# Altium schematic sheet fastic.SchDoc: FastIC+ readout
size 594 x 420 mm; CheckedBy: Jerome A. Alozy; CompanyName: CERN; DrawnBy: Vojtech Vosahlo; Organization: CERN; Address1: European Organization for Nuclear Research; Address2: CH-1211 Genève 23 - Switzerland; Revision: 2.0; SheetNumber: 2; SheetTotal: 7; Projet: Fast Timing; ModifiedBy: -; CreateDate: 11/1/2024; CheckedDate: -; DivGrp: EP-ESE; Designer: Vojtech Vosahlo; ModifiedDate: -
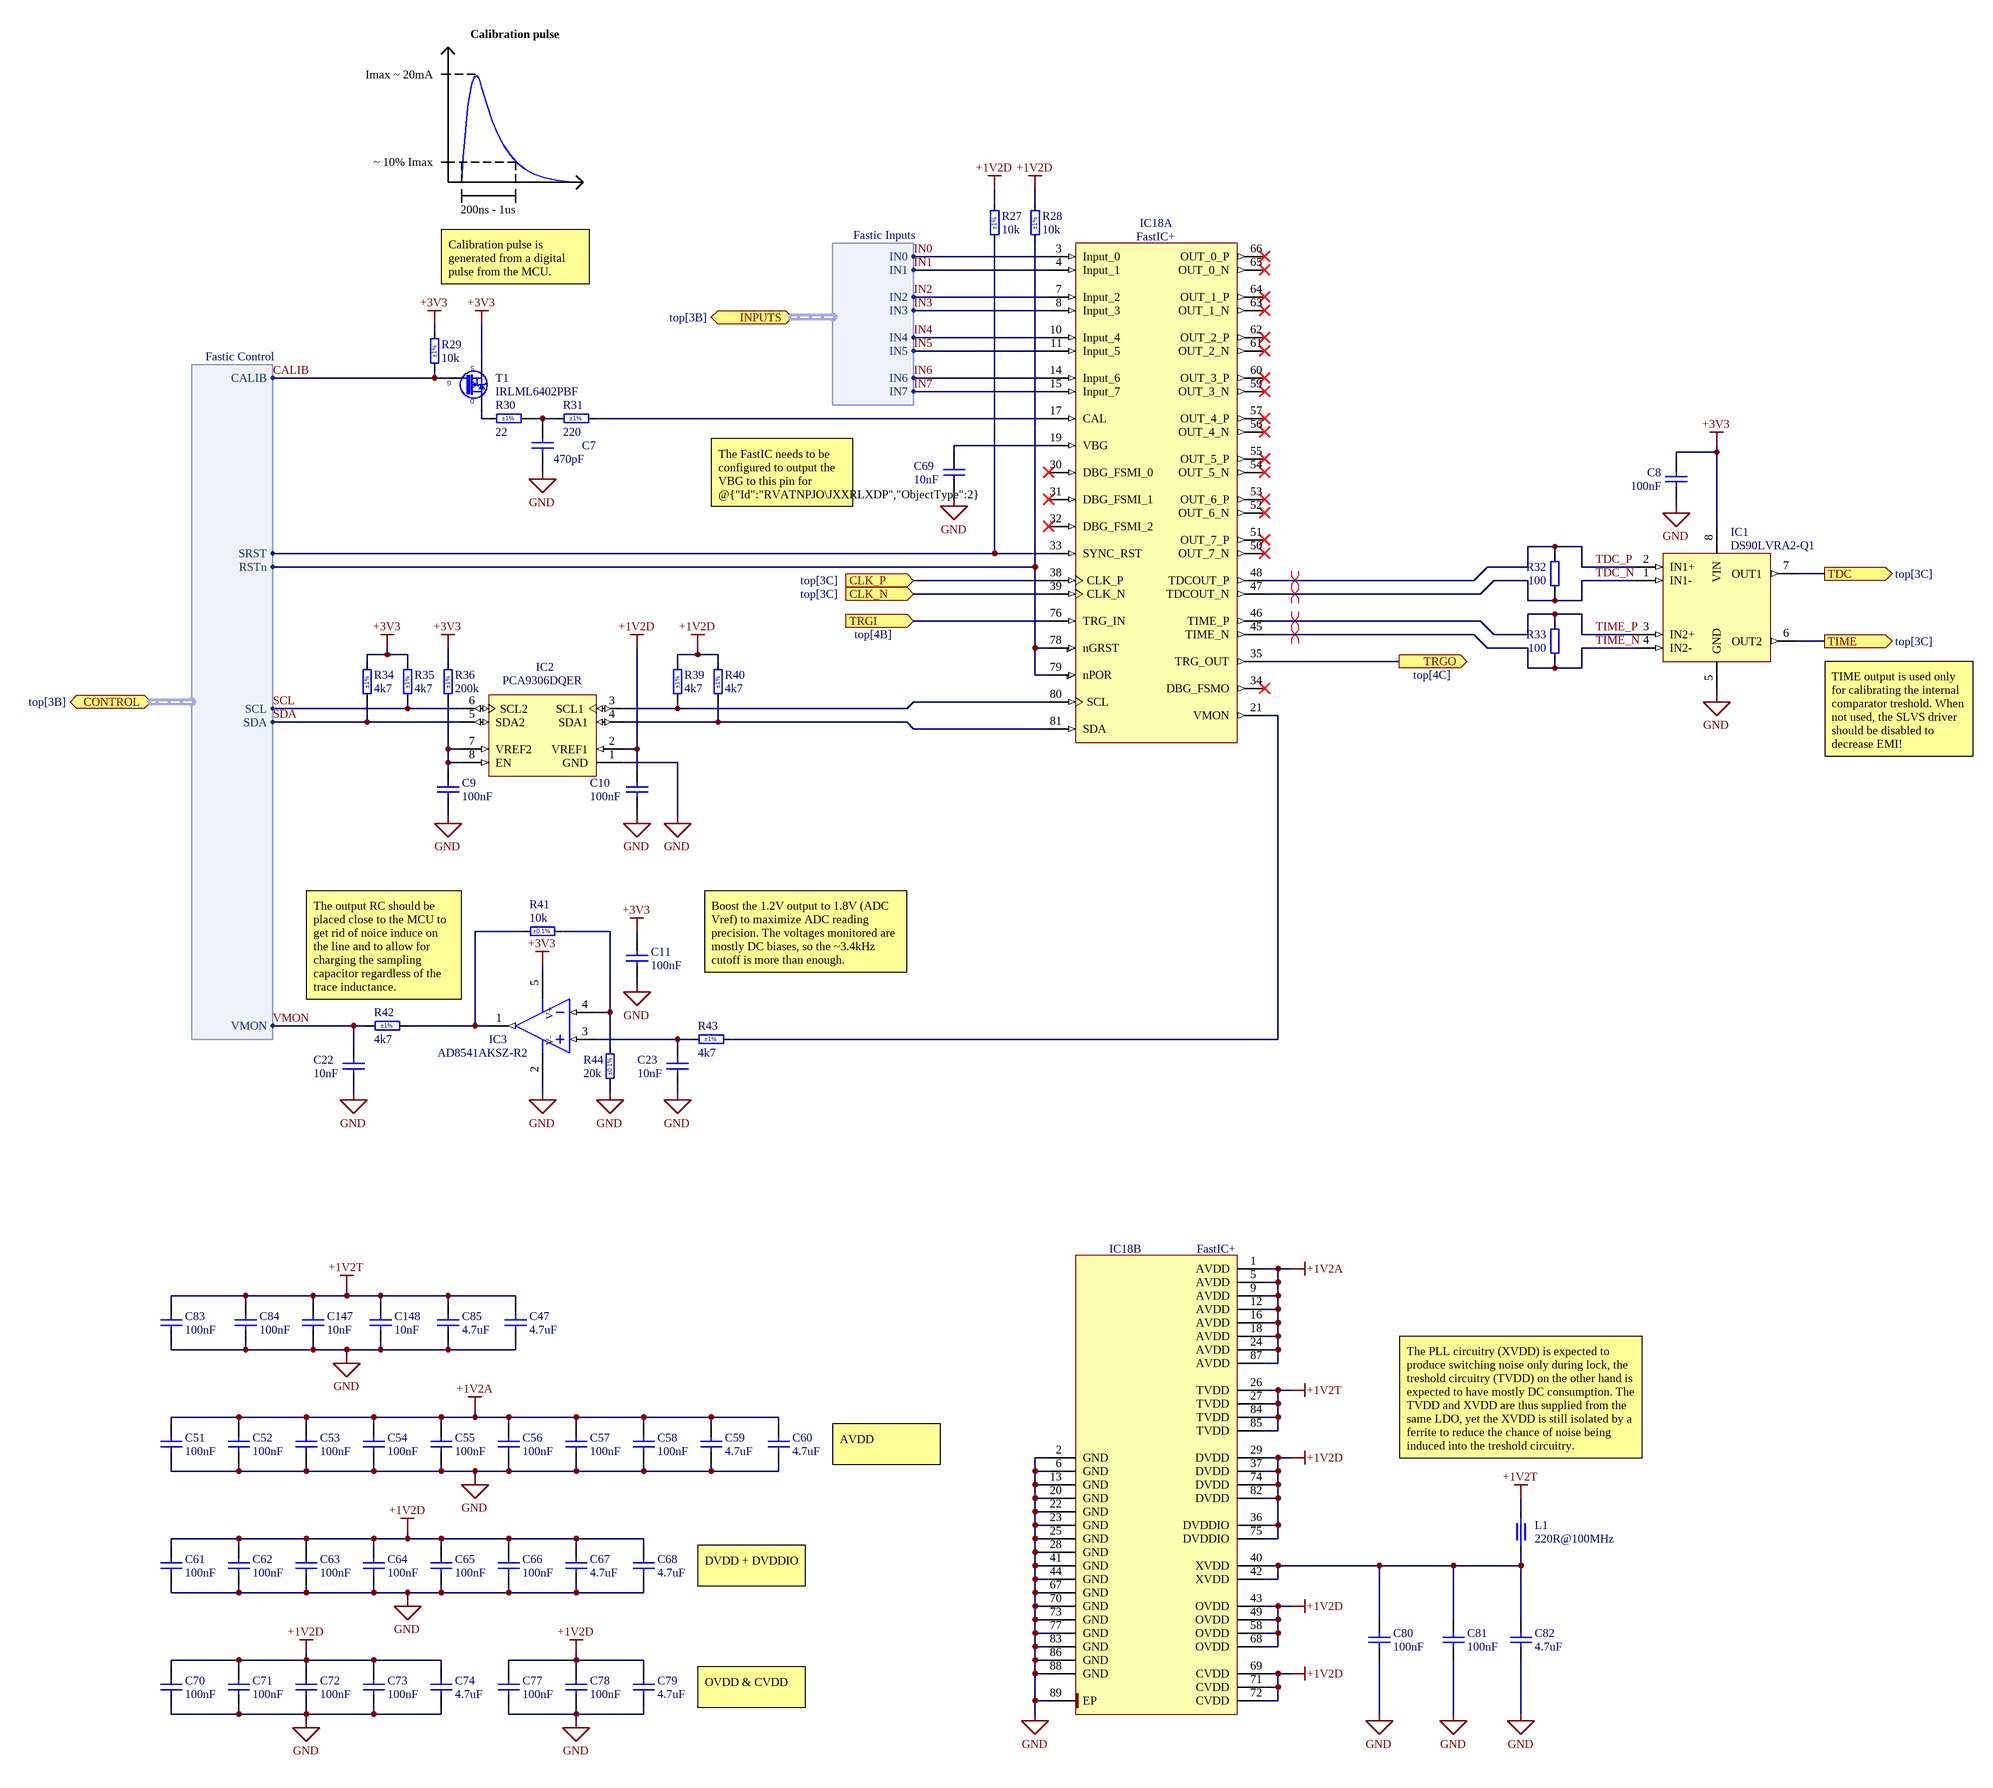
[diagram p0: fastic.SchDoc]

## Parts
C7  470pF  [CAPC1005X55N]
C8  100nF  [CAPC1005X55N]
C9  100nF  [CAPC1005X55N]
C10  100nF  [CAPC1005X55N]
C11  100nF  [CAPC1005X55N]
C22  10nF  [CAPC1005X55N]
C23  10nF  [CAPC1005X55N]
C47  4.7uF  [CAPC1608X87N]
C51  100nF  [CAPC1005X55N]
C52  100nF  [CAPC1005X55N]
C53  100nF  [CAPC1005X55N]
C54  100nF  [CAPC1005X55N]
C55  100nF  [CAPC1005X55N]
C56  100nF  [CAPC1005X55N]
C57  100nF  [CAPC1005X55N]
C58  100nF  [CAPC1005X55N]
C59  4.7uF  [CAPC1608X87N]
C60  4.7uF  [CAPC1608X87N]
C61  100nF  [CAPC1005X55N]
C62  100nF  [CAPC1005X55N]
C63  100nF  [CAPC1005X55N]
C64  100nF  [CAPC1005X55N]
C65  100nF  [CAPC1005X55N]
C66  100nF  [CAPC1005X55N]
C67  4.7uF  [CAPC1608X87N]
C68  4.7uF  [CAPC1608X87N]
C69  10nF  [CAPC1005X55N]
C70  100nF  [CAPC1005X55N]
C71  100nF  [CAPC1005X55N]
C72  100nF  [CAPC1005X55N]
C73  100nF  [CAPC1005X55N]
C74  4.7uF  [CAPC1608X87N]
C77  100nF  [CAPC1005X55N]
C78  100nF  [CAPC1005X55N]
C79  4.7uF  [CAPC1608X87N]
C80  100nF  [CAPC1005X55N]
C81  100nF  [CAPC1005X55N]
C82  4.7uF  [CAPC1608X87N]
C83  100nF  [CAPC1005X55N]
C84  100nF  [CAPC1005X55N]
C85  4.7uF  [CAPC1608X87N]
C147  10nF  [CAPC1005X55N]
C148  10nF  [CAPC1005X55N]
IC1  DS90LVRA2-Q1  [DS90LVRA2-Q1]
IC2  PCA9306DQER  [SON35P100X140X40-8N]
IC3  AD8541AKSZ-R2  [SOT65P210X110-5N]
IC18  FastIC+  [QFN40P1000X1000X85-89N-S760]  (parts A,B of 2)
L1  220R@100MHz  [INDC1005X55N]
R27  10k  Tolerance: ±1%  [RESC1005X40N]
R28  10k  Tolerance: ±1%  [RESC1005X40N]
R29  10k  Tolerance: ±1%  [RESC1005X40N]
R30  22  Tolerance: ±1%  [RESC1005X40N]
R31  220  Tolerance: ±1%  [RESC1005X40N]
R32  100  [RESC1005X40N]
R33  100  [RESC1005X40N]
R34  4k7  Tolerance: ±1%  [RESC1005X40N]
R35  4k7  Tolerance: ±1%  [RESC1005X40N]
R36  200k  Tolerance: ±1%  [RESC1005X40N]
R39  4k7  Tolerance: ±1%  [RESC1005X40N]
R40  4k7  Tolerance: ±1%  [RESC1005X40N]
R41  10k  Tolerance: ±0.1%  [RESC1005X35N]
R42  4k7  Tolerance: ±1%  [RESC1005X40N]
R43  4k7  Tolerance: ±1%  [RESC1005X40N]
R44  20k  Tolerance: ±0.1%  [RESC1005X40N]
T1  IRLML6402PBF  [SOT95P237X112-3N]

## Ports
CLK_N (in, see top[3C]), CLK_P (in, see top[3C]), CONTROL (bidir, harness Fastic Control, see top[3B]), INPUTS (bidir, harness Fastic Inputs, see top[3B]), TDC (out, see top[3C]), TIME (out, see top[3C]), TRGI (in, see top[4B]), TRGO (out, see top[4C])

## Harnesses
Fastic Inputs: IN0, IN1, IN2, IN3, IN4, IN5, IN6, IN7
Fastic Control: CALIB, SRST, RSTn, SDA, VMON, SCL

## Nets
+1V2A: C51.1 C52.1 C53.1 C54.1 C55.1 C56.1 C57.1 C58.1 C59.1 C60.1 IC18.1(AVDD) IC18.5(AVDD) IC18.9(AVDD) IC18.12(AVDD) IC18.16(AVDD) IC18.18(AVDD) IC18.24(AVDD) IC18.87(AVDD)
+1V2D: C10.1 C61.1 C62.1 C63.1 C64.1 C65.1 C66.1 C67.1 C68.1 C70.1 C71.1 C72.1 C73.1 C74.1 C77.1 C78.1 C79.1 IC2.2(VREF1) IC18.29(DVDD) IC18.36(DVDDIO) IC18.37(DVDD) IC18.43(OVDD) IC18.49(OVDD) IC18.58(OVDD) IC18.68(OVDD) IC18.69(CVDD) IC18.71(CVDD) IC18.72(CVDD) IC18.74(DVDD) IC18.75(DVDDIO) IC18.82(DVDD) R27.2 R28.2 R39.2 R40.2
+1V2T: C47.1 C83.1 C84.1 C85.1 C147.1 C148.1 IC18.26(TVDD) IC18.27(TVDD) IC18.84(TVDD) IC18.85(TVDD) L1.2
+3V3: C8.1 C11.2 IC1.8(VIN) IC3.5(V+) R29.2 R34.2 R35.2 R36.2 T1.2(S)
GND: C7.1 C8.2 C9.2 C10.2 C11.1 C22.1 C23.1 C47.2 C51.2 C52.2 C53.2 C54.2 C55.2 C56.2 C57.2 C58.2 C59.2 C60.2 C61.2 C62.2 C63.2 C64.2 C65.2 C66.2 C67.2 C68.2 C69.2 C70.2 C71.2 C72.2 C73.2 C74.2 C77.2 C78.2 C79.2 C80.2 C81.2 C82.2 C83.2 C84.2 C85.2 C147.2 C148.2 IC1.5(GND) IC2.1(GND) IC3.2(V-) IC18.2(GND) IC18.6(GND) IC18.13(GND) IC18.20(GND) IC18.22(GND) IC18.23(GND) IC18.25(GND) IC18.28(GND) IC18.41(GND) IC18.44(GND) IC18.67(GND) IC18.70(GND) IC18.73(GND) IC18.77(GND) IC18.83(GND) IC18.86(GND) IC18.88(GND) IC18.89(EP) R44.1
CALIB: R29.1 T1.1(G) ; port CONTROL.CALIB
CLK_N: IC18.39(CLK_N) ; port CLK_N
CLK_P: IC18.38(CLK_P) ; port CLK_P
IN0: IC18.3(Input_0) ; port INPUTS.IN0
IN1: IC18.4(Input_1) ; port INPUTS.IN1
IN2: IC18.7(Input_2) ; port INPUTS.IN2
IN3: IC18.8(Input_3) ; port INPUTS.IN3
IN4: IC18.10(Input_4) ; port INPUTS.IN4
IN5: IC18.11(Input_5) ; port INPUTS.IN5
IN6: IC18.14(Input_6) ; port INPUTS.IN6
IN7: IC18.15(Input_7) ; port INPUTS.IN7
SCL: IC2.6(SCL2) R35.1 ; port CONTROL.SCL
SDA: IC2.5(SDA2) R34.1 ; port CONTROL.SDA
TDC: IC1.7(OUT1) ; port TDC
TDC_N: IC1.1(IN1-) IC18.47(TDCOUT_N) R32.2
TDC_P: IC1.2(IN1+) IC18.48(TDCOUT_P) R32.1
TIME: IC1.6(OUT2) ; port TIME
TIME_N: IC1.4(IN2-) IC18.45(TIME_N) R33.2
TIME_P: IC1.3(IN2+) IC18.46(TIME_P) R33.1
TRGI: IC18.76(TRG_IN) ; port TRGI
TRGO: IC18.35(TRG_OUT) ; port TRGO
VMON: C22.2 R42.2 ; port CONTROL.VMON
NetC7_2: C7.2 R30.2 R31.1
NetC9_1: C9.1 IC2.7(VREF2) IC2.8(EN) R36.1
NetC23_2: C23.2 IC3.3(IN+) R43.2
NetC69_1: C69.1 IC18.19(VBG)
NetC80_1: C80.1 C81.1 C82.1 IC18.40(XVDD) IC18.42(XVDD) L1.1
NetIC2_3: IC2.3(SCL1) IC18.80(SCL) R39.1
NetIC2_4: IC2.4(SDA1) IC18.81(SDA) R40.1
NetIC3_1: IC3.1(OUT) R41.1 R42.1
NetIC3_4: IC3.4(IN-) R41.2 R44.2
NetIC18_17: IC18.17(CAL) R31.2
NetIC18_21: IC18.21(VMON) R43.1
NetIC18_33: IC18.33(SYNC_RST) R27.1 ; port CONTROL.SRST
NetIC18_78: IC18.78(nGRST) IC18.79(nPOR) R28.1 ; port CONTROL.RSTn
NetR30_1: R30.1 T1.3(D)

Not connected (* = marked no-connect by the designer): IC18 30(DBG_FSMI_0)* 31(DBG_FSMI_1)* 32(DBG_FSMI_2)* 34(DBG_FSMO)* 50(OUT_7_N)* 51(OUT_7_P)* 52(OUT_6_N)* 53(OUT_6_P)* 54(OUT_5_N)* 55(OUT_5_P)* 56(OUT_4_N)* 57(OUT_4_P)* 59(OUT_3_N)* 60(OUT_3_P)* 61(OUT_2_N)* 62(OUT_2_P)* 63(OUT_1_N)* 64(OUT_1_P)* 65(OUT_0_N)* 66(OUT_0_P)*

## Layout directives
differential pair: TDC_N, TDC_P, TIME_N, TIME_P

## Notes on the sheet
- Calibration pulse
- Imax ~ 20mA
- ~ 10% Imax
- 200ns - 1us
- Calibration pulse is generated from a digital pulse from the MCU.
- The FastIC needs to be configured to output the VBG to this pin for @{"Id":"RVATNPJO\JXXRLXDP","ObjectType":2} to take effect!
- TIME output is used only for calibrating the internal comparator treshold. When not used, the SLVS driver should be disabled to decrease EMI!
- Boost the 1.2V output to 1.8V (ADC Vref) to maximize ADC reading precision. The voltages monitored are mostly DC biases, so the ~3.4kHz cutoff is more than enough.
- (near R42) The output RC should be placed close to the MCU to get rid of noice induce on the line and to allow for charging the sampling capacitor regardless of the trace inductance.
- AVDD
- The PLL circuitry (XVDD) is expected to produce switching noise only during lock, the treshold circuitry (TVDD) on the other hand is expected to have mostly DC consumption. The TVDD and XVDD are thus supplied from the same LDO, yet the XVDD is still isolated by a ferrite to reduce the chance of noise being induced into the treshold circuitry.
- DVDD + DVDDIO
- OVDD & CVDD
- Project/Equipment
- Document
- File
- Designer
- Drawn by
- Check.by
- Last Mod.
- Print Date
- Sheet
- Size
- A2
- of
- Rev

## Library data of the parts
C7 = CC0402_470PF_50V_10%_X7R: Non-polarised capacitor; Part Description: SMD Multilayer Chip Ceramic Capacitor; Manufacturer: GENERIC; Manufacturer1 Part Number: 223858715618; Voltage: 50V; TC: X7R; Tolerance: ±10%; Part Number: CC0402_470PF_50V_10%_X7R; Component Kind: Standard; Component Type: Standard; Pin Count: 2; Value: 470pF; Status: Not Recommended; Manufacturer Part Number: CC0402_470PF_50V_10%_X7R; Case: 0402; Mounted: Yes; Socket: No; SMD: Yes; Sense: No; Manufacturer1 Example: PHYCOMP; Manufacturer1 ComponentHeight: 0.55mm; HelpURL: \\cern.ch\dfs\Applications\Altium\Datasheets\CC0402_NP0_PHYCOMP.pdf; Author: CERN DEM JLC; CreateDate: 12/3/2007; LatestRevisionDate: 12/3/2007
C8-C11 C51-C58 C61-C66 C70-C73 C77 C78 C80 C81 C83 C84 = CC0402_100NF_16V_10%_X7R: Non-polarised capacitor; Part Description: SMD Multilayer Chip Ceramic Capacitor; Manufacturer: GENERIC; Manufacturer1 Part Number: GRM155R71C104KA88D; Voltage: 16V; TC: X7R; Tolerance: ±10%; Part Number: CC0402_100NF_16V_10%_X7R; Component Kind: Standard; Component Type: Standard; Pin Count: 2; Value: 100nF; Status: Not Recommended; Manufacturer Part Number: CC0402_100NF_16V_10%_X7R; Case: 0402; Mounted: Yes; Socket: No; SMD: Yes; Sense: No; HelpURL: \\cern.ch\dfs\Applications\Altium\Datasheets\CC0402_X7R_MURATA_GRM.pdf; Author: CERN DEM JLC; CreateDate: 12/5/2013; LatestRevisionDate: 12/3/2007; Manufacturer1 Example: MURATA; Manufacturer1 ComponentHeight: 0.55mm
C22 C23 C69 C147 C148 = CC0402_10NF_50V_10%_X7R: Non-polarised capacitor; Part Description: SMD Multilayer Chip Ceramic Capacitor; Manufacturer: GENERIC; Manufacturer1 Part Number: GRM155R71H103KA88D; Voltage: 50V; TC: X7R; Tolerance: ±10%; Part Number: CC0402_10NF_50V_10%_X7R; Component Kind: Standard; Component Type: Standard; Pin Count: 2; Value: 10nF; Status: None; Manufacturer Part Number: CC0402_10NF_50V_10%_X7R; Case: 0402; Mounted: Yes; Socket: No; SMD: Yes; Sense: No; Manufacturer1 Example: MURATA; Manufacturer1 ComponentHeight: 0.55mm; HelpURL: \\cern.ch\dfs\Applications\Altium\Datasheets\CC0402_X7R_MURATA_GRM.pdf; Author: CERN DEM MR; CreateDate: 1/8/2016; LatestRevisionDate: 1/8/2016
C47 C59 C60 C67 C68 C74 C79 C82 C85 = CC0603_4.7UF_6.3V_10%_X5R: Non-polarised capacitor; Part Description: SMD Multilayer Chip Ceramic Capacitor; Manufacturer: GENERIC; Manufacturer1 Part Number: 225520613672; Voltage: 6.3V; TC: X5R; Tolerance: ±10%; Part Number: CC0603_4.7UF_6.3V_10%_X5R; Component Kind: Standard; Component Type: Standard; Pin Count: 2; Value: 4.7uF; Status: Preferred; Manufacturer Part Number: CC0603_4.7UF_6.3V_10%_X5R; Case: 0603; Mounted: Yes; Socket: No; SMD: Yes; Sense: No; Manufacturer1 Example: PHYCOMP; Manufacturer1 ComponentHeight: 0.87mm; HelpURL: \\cern.ch\dfs\Applications\Altium\Datasheets\CC0805_X5R_PHYCOMP_HC.pdf; Author: CERN DEM JLC; CreateDate: 12/3/2007; LatestRevisionDate: 12/3/2007
IC3 = AD8541AKSZ-R2: Operational Amplifier; Part Description: CMOS Rail-to-Rail General-Purpose Amplifier; Manufacturer: ANALOG DEVICES; PressFit: No; Bonding: No; Part Number: AD8541AKSZ-R2; Component Kind: Standard; Component Type: Standard; Device: AD8541AKSZ-R2; PackageDescription: SOT353, SC70-5, SOT, 0.65mm Pitch; 5 Pin, 1.25mm W X 2.00mm L X 1.10mm H body, IPC Medium Density; Manufacturer Part Number: AD8541AKS; Pin Count: 5; Case: SOT353; Mounted: Yes; Socket: No; SMD: Yes; Sense: No; ComponentHeight: 1.1mm; Author: CERN DEM JLC; HelpURL: \\cern.ch\dfs\Applications\Altium\Datasheets\AD8541AKSZ-R2.pdf; CreateDate: 4/25/2012; LatestRevisionDate: 3/29/2022
IC18 = FastIC+: Part Description: FastIC+ ASIC. Fast Integrated Circuit for  Readout of High-Performance Detectors with Embedded TDC; Manufacturer: CERN; PressFit: No; Bonding: No; Part Number: FastIC+; Component Kind: Standard; Component Type: Standard; Device: FastIC+; PackageDescription: QFN, 0.40mm Pitch, Square; 89 Pin, 10.00mm L X 10.00mm W X 0.85mm H body (w/Thermal Tab 7.6 X 7.60mm), IPC Medium Density; Manufacturer Part Number: FastIC+; Pin Count: 89; Case: QFN89; Mounted: Yes; Socket: No; SMD: Yes; Sense: No; ComponentHeight: 0.85mm; Author: CERN DEM HF; HelpURL: \\cern.ch\dfs\Applications\Altium\Datasheets\FastIC+.pdf; ComponentLink1URL: \\cern.ch\dfs\Applications\Altium\Datasheets\FastIC+_Package.pdf; ComponentLink1Description: Package Drawing; CreateDate: 12/14/2023; LatestRevisionDate: 12/14/2023
L1 = IND0402_MURATA_BLM15HB221SN1: Part Description: SMD EMIFIL Suppression Chip Ferrite Bead; Manufacturer: MURATA; Power: 250mA; Resistance: 1R; Tolerance: ±25%; Part Number: IND0402_MURATA_BLM15HB221SN1; Component Kind: Standard; Component Type: Standard; Pin Count: 2; Value: 220R@100MHz; Manufacturer Part Number: BLM15HB221SN1; Case: 0402; Mounted: Yes; Socket: No; SMD: Yes; Sense: No; ComponentHeight: 0.55mm; HelpURL: \\cern.ch\dfs\Applications\Altium\Datasheets\IND0402_MURATA_BLM15H.pdf; Author: CERN DEM JLC; CreateDate: 6/23/2009; LatestRevisionDate: 10/25/2018
R27-R29 = R0402_10K_1%_0.0625W_100PPM: Resistor - 1%; Part Description: General Purpose Thick Film Chip Resistor; Manufacturer: GENERIC; Manufacturer1 Part Number: 232270671003L; TC: ±100ppm/°C; PressFit: No; Part Number: R0402_10K_1%_0.0625W_100PPM; Component Kind: Standard; Component Type: Standard; Pin Count: 2; Value: 10k; Status: Not Recommended; Power: 0.0625W; Manufacturer Part Number: R0402_10K_1%_0.0625W_100PPM; Case: 0402; Mounted: Yes; Sense: No; Socket: No; SMD: Yes; Manufacturer1 Example: YAGEO PHYCOMP; Manufacturer1 ComponentHeight: 0.4mm; HelpURL: \\cern.ch\dfs\Applications\Altium\Datasheets\R0402_Phycomp_RC0402.pdf; Author: CERN DEM JLC; CreateDate: 12/3/2007; LatestRevisionDate: 10/17/2012
R30 = R0402_22R_1%_0.0625W_100PPM: Resistor - 1%; Part Description: General Purpose Thick Film Chip Resistor; Manufacturer: GENERIC; Manufacturer1 Part Number: 232270672209L; TC: ±100ppm/°C; PressFit: No; Part Number: R0402_22R_1%_0.0625W_100PPM; Component Kind: Standard; Component Type: Standard; Pin Count: 2; Value: 22; Status: Not Recommended; Power: 0.0625W; Manufacturer Part Number: R0402_22R_1%_0.0625W_100PPM; Case: 0402; Mounted: Yes; Sense: No; Socket: No; SMD: Yes; Manufacturer1 Example: YAGEO PHYCOMP; Manufacturer1 ComponentHeight: 0.4mm; HelpURL: \\cern.ch\dfs\Applications\Altium\Datasheets\R0402_Phycomp_RC0402.pdf; Author: CERN DEM JLC; CreateDate: 12/3/2007; LatestRevisionDate: 10/17/2012
R31 = R0402_220R_1%_0.0625W_100PPM: Resistor - 1%; Part Description: General Purpose Thick Film Chip Resistor; Manufacturer: GENERIC; Manufacturer1 Part Number: 232270672201L; TC: ±100ppm/°C; PressFit: No; Part Number: R0402_220R_1%_0.0625W_100PPM; Component Kind: Standard; Component Type: Standard; Pin Count: 2; Value: 220; Status: Not Recommended; Power: 0.0625W; Manufacturer Part Number: R0402_220R_1%_0.0625W_100PPM; Case: 0402; Mounted: Yes; Sense: No; Socket: No; SMD: Yes; Manufacturer1 Example: YAGEO PHYCOMP; Manufacturer1 ComponentHeight: 0.4mm; HelpURL: \\cern.ch\dfs\Applications\Altium\Datasheets\R0402_Phycomp_RC0402.pdf; Author: CERN DEM JLC; CreateDate: 12/3/2007; LatestRevisionDate: 10/17/2012
R32 R33 = R0402_100R_1%_0.1W_100PPM: Resistor - 1%; Part Description: General Purpose Thick Film Chip Resistor; Manufacturer: GENERIC; Manufacturer Part Number: R0402_100R_1%_0.1W_100PPM_50V; Manufacturer1 Part Number: ERJ2RKF1000X; Power: 0.1W; TC: ±100ppm/°C; PressFit: No; Voltage: 50V; Part Number: R0402_100R_1%_0.1W_100PPM; Component Kind: Standard; Component Type: Standard; Pin Count: 2; Value: 100; Status: Not Recommended; Tolerance: ±1%; Case: 0402; Mounted: Yes; Sense: No; Socket: No; SMD: Yes; Manufacturer1 Example: PANASONIC; Manufacturer1 ComponentHeight: 0.4mm; HelpURL: \\cern.ch\dfs\Applications\Altium\Datasheets\R0402_PANASONIC_ERJ2RK.pdf; Author: CERN DEM JLC; CreateDate: 12/12/2013; LatestRevisionDate: 3/3/2015
R34 R35 R39 R40 R42 R43 = R0402_4K7_1%_0.0625W_100PPM: Resistor - 1%; Part Description: General Purpose Thick Film Chip Resistor; Manufacturer: GENERIC; Manufacturer1 Part Number: 232270674702L; TC: ±100ppm/°C; PressFit: No; Part Number: R0402_4K7_1%_0.0625W_100PPM; Component Kind: Standard; Component Type: Standard; Pin Count: 2; Value: 4k7; Status: Not Recommended; Power: 0.0625W; Manufacturer Part Number: R0402_4K7_1%_0.0625W_100PPM; Case: 0402; Mounted: Yes; Sense: No; Socket: No; SMD: Yes; Manufacturer1 Example: YAGEO PHYCOMP; Manufacturer1 ComponentHeight: 0.4mm; HelpURL: \\cern.ch\dfs\Applications\Altium\Datasheets\R0402_Phycomp_RC0402.pdf; Author: CERN DEM JLC; CreateDate: 12/3/2007; LatestRevisionDate: 10/17/2012
R36 = R0402_200K_1%_0.0625W_100PPM: Resistor - 1%; Part Description: General Purpose Thick Film Chip Resistor; Manufacturer: GENERIC; Manufacturer1 Part Number: 232270672004L; TC: ±100ppm/°C; PressFit: No; Part Number: R0402_200K_1%_0.0625W_100PPM; Component Kind: Standard; Component Type: Standard; Pin Count: 2; Value: 200k; Status: Not Recommended; Power: 0.0625W; Manufacturer Part Number: R0402_200K_1%_0.0625W_100PPM; Case: 0402; Mounted: Yes; Sense: No; Socket: No; SMD: Yes; Manufacturer1 Example: YAGEO PHYCOMP; Manufacturer1 ComponentHeight: 0.4mm; HelpURL: \\cern.ch\dfs\Applications\Altium\Datasheets\R0402_Phycomp_RC0402.pdf; Author: CERN DEM JLC; CreateDate: 12/3/2007; LatestRevisionDate: 10/17/2012
R41 = R0402_10K_0.1%_0.063W_25PPM: Resistor - 0.1%; Part Description: Thin Film Precision Resistor; Manufacturer: GENERIC; Manufacturer1 Part Number: CPF0402B10KE1; Power: 0.063W; TC: ±25ppm/°C; PressFit: No; Part Number: R0402_10K_0.1%_0.063W_25PPM; Component Kind: Standard; Component Type: Standard; Pin Count: 2; Value: 10k; Status: Not Recommended; Manufacturer Part Number: R0402_10K_0.1%_0.063W_25PPM; Case: 0402; Mounted: Yes; Sense: No; Socket: No; SMD: Yes; Manufacturer1 Example: TE CONNECTIVITY; Manufacturer1 ComponentHeight: 0.35mm; HelpURL: \\cern.ch\dfs\Applications\Altium\Datasheets\R0402_TYCO_CPF.pdf; Author: CERN DEM JMW; CreateDate: 9/22/2015; LatestRevisionDate: 9/22/2015
R44 = R0402_20K_0.1%_0.063W_25PPM: Resistor - 0.1%; Part Description: Thin Film Precision Resistor; Manufacturer: GENERIC; Manufacturer1 Part Number: ERA2AEB203X; Power: 0.063W; TC: ±25ppm/°C; Voltage: 50V; PressFit: No; Part Number: R0402_20K_0.1%_0.063W_25PPM; Component Kind: Standard; Component Type: Standard; Pin Count: 2; Value: 20k; Status: Not Recommended; Manufacturer Part Number: R0402_20K_0.1%_0.063W_25PPM; Case: 0402; Mounted: Yes; Sense: No; Socket: No; SMD: Yes; Manufacturer1 Example: PANASONIC; Manufacturer1 ComponentHeight: 0.4mm; HelpURL: \\cern.ch\dfs\Applications\Altium\Datasheets\R0402_PANASONIC_ERA.pdf; Author: CERN DEM BC; CreateDate: 7/10/2020; LatestRevisionDate: 7/10/2020
T1 = IRLML6402PBF: P-CHANNEL MOSFET WITH ZENER DIODE; Part Description: -20V -3.7A P-Channel HEXFET® Power MOSFET; Manufacturer: INTERNATIONAL RECTIFIER; PressFit: No; Bonding: No; Part Number: IRLML6402PBF; Component Kind: Standard; Component Type: Standard; Device: IRLML6402PBF; PackageDescription: SOT23, 0.95mm Pitch; 3 Pin, 1.30mm W X 2.92mm L X 1.12mm H body, IPC Medium Density; Manufacturer Part Number: IRLML6402; Pin Count: 3; Case: SOT23-3; Mounted: Yes; Socket: No; SMD: Yes; Sense: No; ComponentHeight: 1.12mm; HelpURL: \\cern.ch\dfs\Applications\Altium\Datasheets\IRLML6402PBF.pdf; Author: CERN DEM JLC; CreateDate: 8/29/2011; LatestRevisionDate: 8/29/2011